# Altium schematic sheet Power.SchDoc
size A3
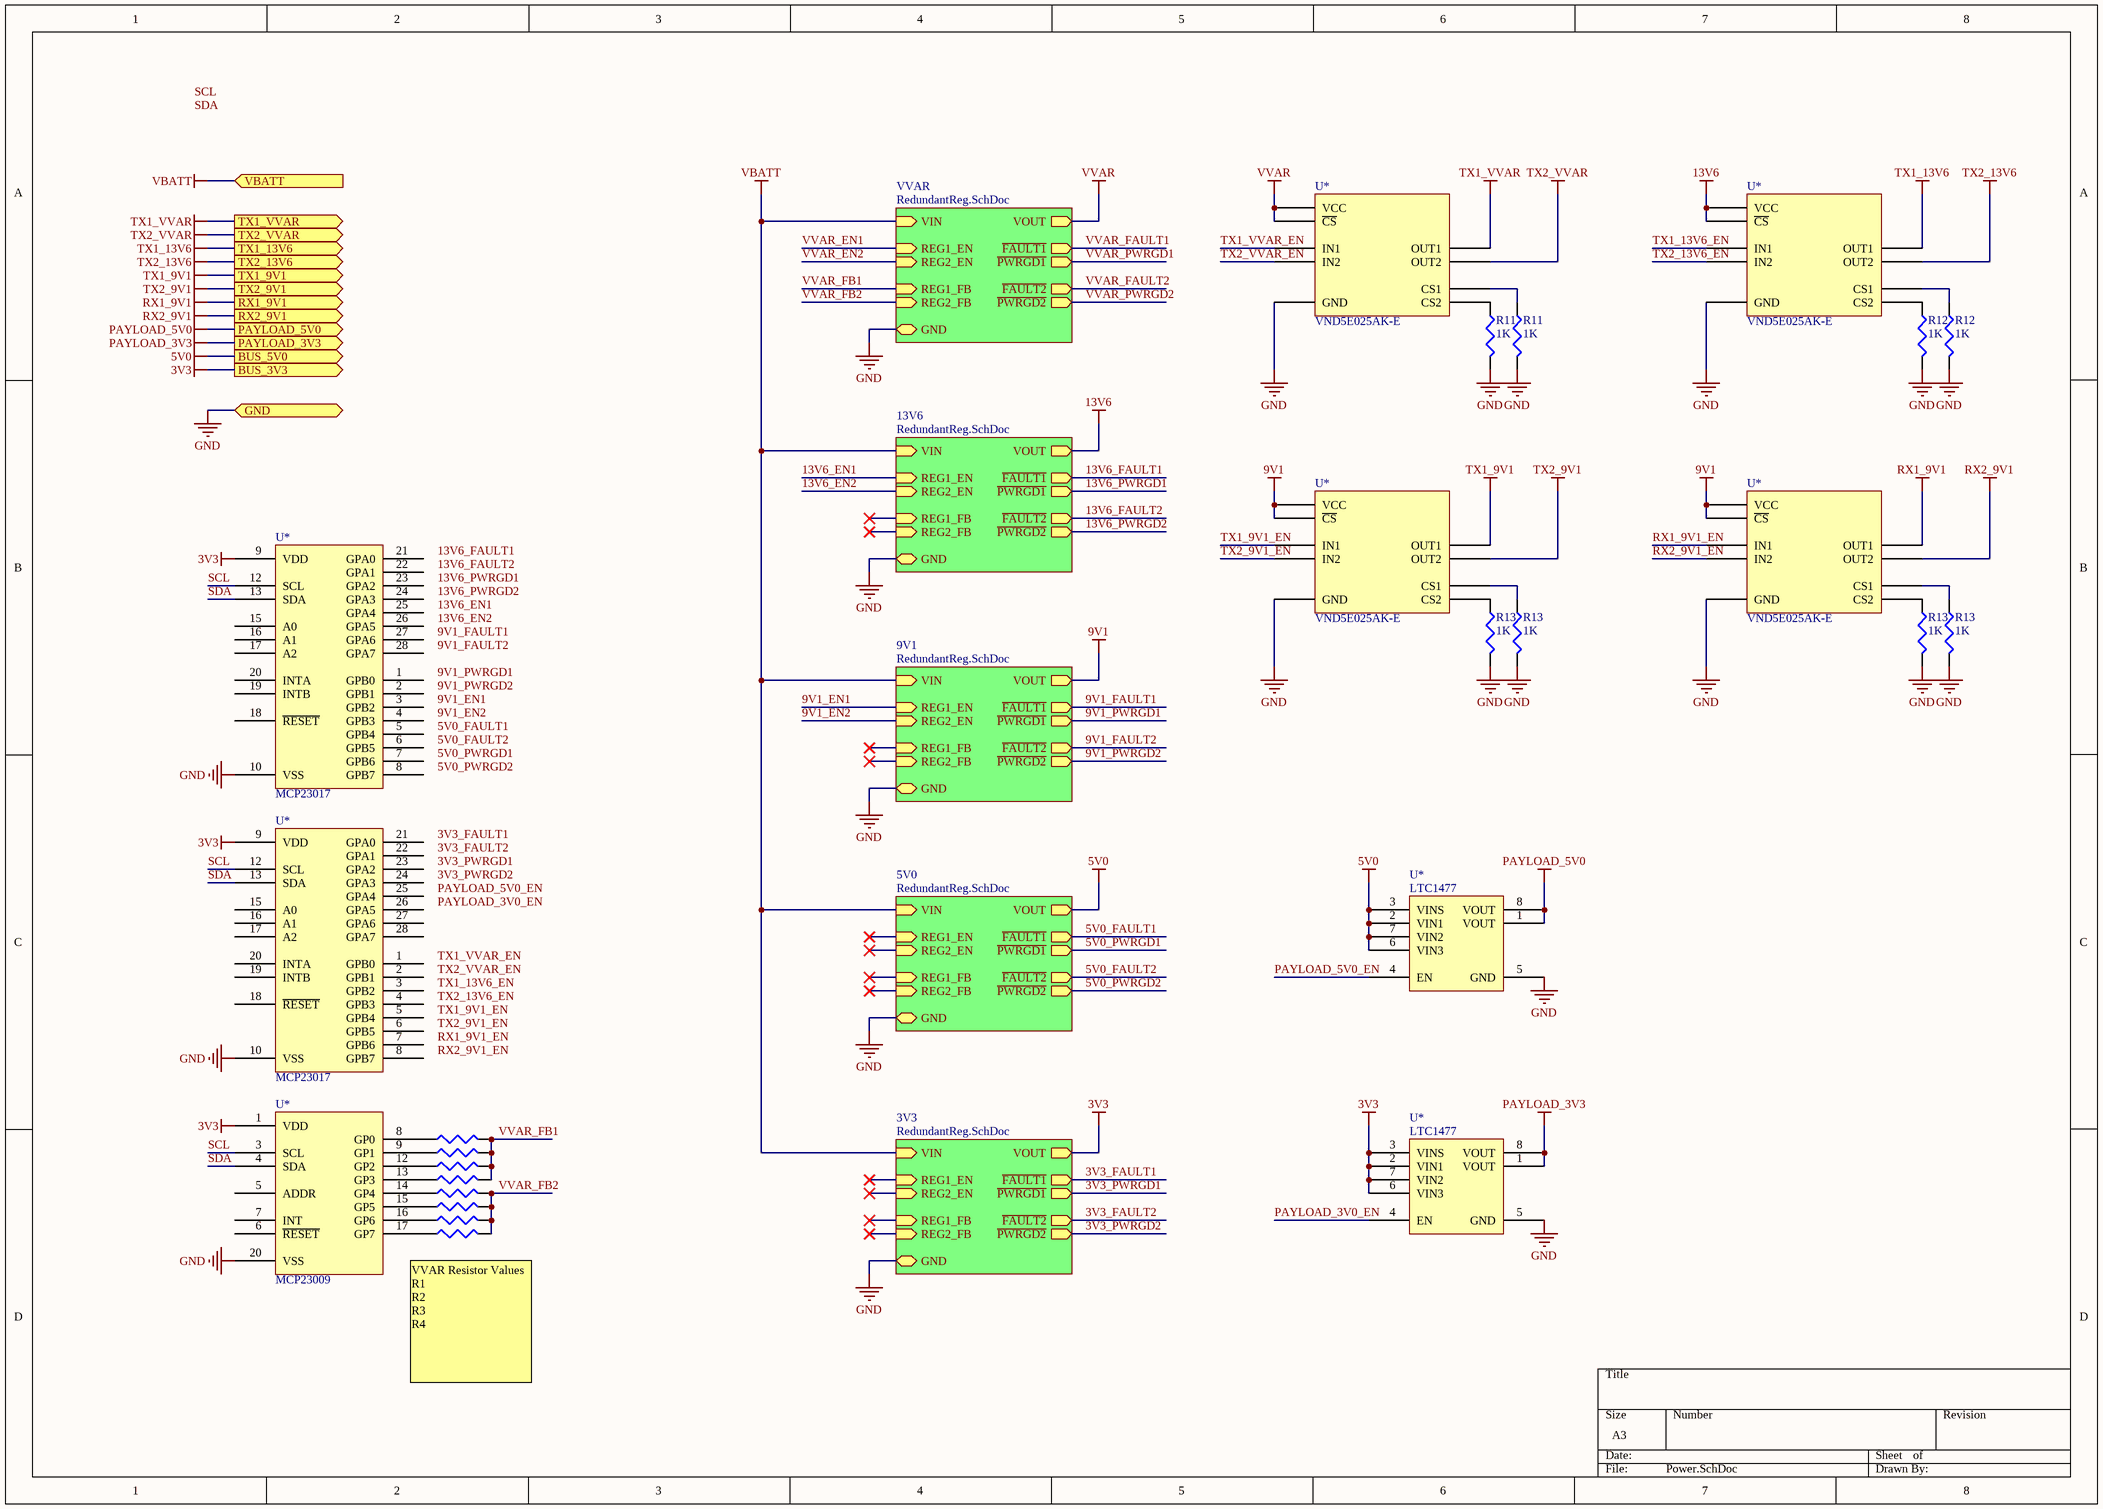
[diagram p0: Power.SchDoc]

## Parts
(Parts that share a designator on the sheet are numbered #1, #2 ... from top to bottom, then left to right.)
R11#1  value 1K  [R0805M]
R11#2  value 1K  [R0805M]
R12#1  value 1K  [R0805M]
R12#2  value 1K  [R0805M]
R13#1  value 1K  [R0805M]
R13#2  value 1K  [R0805M]
R13#3  value 1K  [R0805M]
R13#4  value 1K  [R0805M]
R?#1  VSET_1  [R0805M]  (value not drawn)
R?#2  VSET_1  [R0805M]  (value not drawn)
R?#3  VSET_1  [R0805M]  (value not drawn)
R?#4  VSET_1  [R0805M]  (value not drawn)
R?#5  VSET_1  [R0805M]  (value not drawn)
R?#6  VSET_1  [R0805M]  (value not drawn)
R?#7  VSET_1  [R0805M]  (value not drawn)
R?#8  VSET_1  [R0805M]  (value not drawn)
U*#1  VND5E025AK-E  [SSO24]
U*#2  VND5E025AK-E  [SSO24]
U*#3  VND5E025AK-E  [SSO24]
U*#4  VND5E025AK-E  [SSO24]
U*#5  MCP23017  [SSOP28]
U*#6  LTC1477  [SO8]
U*#7  MCP23017  [SSOP28]
U*#8  LTC1477  [SO8]
U*#9  MCP23009  [SSOP20]

## Sub-sheets
3V3 = RedundantReg.SchDoc: REG1_EN (in), REG2_EN (in), VIN (in), VOUT (out), REG1_FB (in), REG2_FB (in), GND, ~{FAULT1} (out), ~{FAULT2} (out), ~{PWRGD1} (out), ~{PWRGD2} (out)
5V0 = RedundantReg.SchDoc: REG1_EN (in), REG2_EN (in), VIN (in), VOUT (out), REG1_FB (in), REG2_FB (in), GND, ~{FAULT1} (out), ~{FAULT2} (out), ~{PWRGD1} (out), ~{PWRGD2} (out)
9V1 = RedundantReg.SchDoc: REG1_EN (in), REG2_EN (in), VIN (in), VOUT (out), REG1_FB (in), REG2_FB (in), GND, ~{FAULT1} (out), ~{FAULT2} (out), ~{PWRGD1} (out), ~{PWRGD2} (out)
13V6 = RedundantReg.SchDoc: REG1_EN (in), REG2_EN (in), VIN (in), VOUT (out), REG1_FB (in), REG2_FB (in), GND, ~{FAULT1} (out), ~{FAULT2} (out), ~{PWRGD1} (out), ~{PWRGD2} (out)
VVAR = RedundantReg.SchDoc: REG1_EN (in), REG2_EN (in), VIN (in), VOUT (out), REG1_FB (in), REG2_FB (in), GND, ~{FAULT1} (out), ~{FAULT2} (out), ~{PWRGD1} (out), ~{PWRGD2} (out)

## Ports
BUS_3V3 (out), BUS_5V0 (out), GND, PAYLOAD_3V3 (out), PAYLOAD_5V0 (out), RX1_9V1 (out), RX2_9V1 (out), TX1_9V1 (out), TX1_13V6 (out), TX1_VVAR (out), TX2_9V1 (out), TX2_13V6 (out), TX2_VVAR (out), VBATT (in)

## Nets
3V3: U*#5.9(VDD) U*#7.9(VDD) U*#8.2(VIN1) U*#8.3(VINS) U*#8.6(VIN3) U*#8.7(VIN2) U*#9.1(VDD) ; port BUS_3V3, sheet 3V3/VOUT
5V0: U*#6.2(VIN1) U*#6.3(VINS) U*#6.6(VIN3) U*#6.7(VIN2) ; port BUS_5V0, sheet 5V0/VOUT
9V1: U*#3.CS_DIS(~{CS}) U*#3.VCC U*#4.CS_DIS(~{CS}) U*#4.VCC ; sheet 9V1/VOUT
13V6: U*#2.CS_DIS(~{CS}) U*#2.VCC ; sheet 13V6/VOUT
GND: R11#1.2 R11#2.2 R12#1.2 R12#2.2 R13#1.2 R13#2.2 R13#3.2 R13#4.2 U*#1.GND U*#2.GND U*#3.GND U*#4.GND U*#5.10(VSS) U*#6.5(GND) U*#7.10(VSS) U*#8.5(GND) U*#9.20(VSS) ; port GND, sheet 13V6/GND, sheet 9V1/GND, sheet 5V0/GND, sheet 3V3/GND, sheet VVAR/GND
PAYLOAD_3V3: U*#8.1(VOUT) U*#8.8(VOUT) ; port PAYLOAD_3V3
PAYLOAD_5V0: U*#6.1(VOUT) U*#6.8(VOUT) ; port PAYLOAD_5V0
RX1_9V1: U*#4.OUT1 ; port RX1_9V1
RX2_9V1: U*#4.OUT2 ; port RX2_9V1
TX1_9V1: U*#3.OUT1 ; port TX1_9V1
TX1_13V6: U*#2.OUT1 ; port TX1_13V6
TX1_VVAR: U*#1.OUT1 ; port TX1_VVAR
TX2_9V1: U*#3.OUT2 ; port TX2_9V1
TX2_13V6: U*#2.OUT2 ; port TX2_13V6
TX2_VVAR: U*#1.OUT2 ; port TX2_VVAR
VBATT: port VBATT, sheet 13V6/VIN, sheet 9V1/VIN, sheet 5V0/VIN, sheet 3V3/VIN, sheet VVAR/VIN
VVAR: U*#1.CS_DIS(~{CS}) U*#1.VCC ; sheet VVAR/VOUT
3V3_FAULT1: sheet 3V3/~{FAULT1}
3V3_FAULT2: sheet 3V3/~{FAULT2}
3V3_PWRGD1: sheet 3V3/~{PWRGD1}
3V3_PWRGD2: sheet 3V3/~{PWRGD2}
5V0_FAULT1: sheet 5V0/~{FAULT1}
5V0_FAULT2: sheet 5V0/~{FAULT2}
5V0_PWRGD1: sheet 5V0/~{PWRGD1}
5V0_PWRGD2: sheet 5V0/~{PWRGD2}
9V1_EN1: sheet 9V1/REG1_EN
9V1_EN2: sheet 9V1/REG2_EN
9V1_FAULT1: sheet 9V1/~{FAULT1}
9V1_FAULT2: sheet 9V1/~{FAULT2}
9V1_PWRGD1: sheet 9V1/~{PWRGD1}
9V1_PWRGD2: sheet 9V1/~{PWRGD2}
13V6_EN1: sheet 13V6/REG1_EN
13V6_EN2: sheet 13V6/REG2_EN
13V6_FAULT1: sheet 13V6/~{FAULT1}
13V6_FAULT2: sheet 13V6/~{FAULT2}
13V6_PWRGD1: sheet 13V6/~{PWRGD1}
13V6_PWRGD2: sheet 13V6/~{PWRGD2}
PAYLOAD_3V0_EN: U*#8.4(EN)
PAYLOAD_5V0_EN: U*#6.4(EN)
RX1_9V1_EN: U*#4.IN1
RX2_9V1_EN: U*#4.IN2
SCL: U*#5.12(SCL) U*#7.12(SCL) U*#9.3(SCL)
SDA: U*#5.13(SDA) U*#7.13(SDA) U*#9.4(SDA)
TX1_9V1_EN: U*#3.IN1
TX1_13V6_EN: U*#2.IN1
TX1_VVAR_EN: U*#1.IN1
TX2_9V1_EN: U*#3.IN2
TX2_13V6_EN: U*#2.IN2
TX2_VVAR_EN: U*#1.IN2
VVAR_EN1: sheet VVAR/REG1_EN
VVAR_EN2: sheet VVAR/REG2_EN
VVAR_FAULT1: sheet VVAR/~{FAULT1}
VVAR_FAULT2: sheet VVAR/~{FAULT2}
VVAR_FB1: R?#1.2 R?#2.2 R?#3.2 R?#4.2 ; sheet VVAR/REG1_FB
VVAR_FB2: R?#5.2 R?#6.2 R?#7.2 R?#8.2 ; sheet VVAR/REG2_FB
VVAR_PWRGD1: sheet VVAR/~{PWRGD1}
VVAR_PWRGD2: sheet VVAR/~{PWRGD2}
NetR11#1_1: R11#1.1 U*#1.CS2
NetR11#2_1: R11#2.1 U*#1.CS1
NetR12#1_1: R12#1.1 U*#2.CS2
NetR12#2_1: R12#2.1 U*#2.CS1
NetR13#1_1: R13#1.1 U*#3.CS2
NetR13#2_1: R13#2.1 U*#3.CS1
NetR13#3_1: R13#3.1 U*#4.CS2
NetR13#4_1: R13#4.1 U*#4.CS1
NetR?#1_1: R?#1.1 U*#9.8(GP0)
NetR?#2_1: R?#2.1 U*#9.9(GP1)
NetR?#3_1: R?#3.1 U*#9.12(GP2)
NetR?#4_1: R?#4.1 U*#9.13(GP3)
NetR?#5_1: R?#5.1 U*#9.14(GP4)
NetR?#6_1: R?#6.1 U*#9.15(GP5)
NetR?#7_1: R?#7.1 U*#9.16(GP6)
NetR?#8_1: R?#8.1 U*#9.17(GP7)

Not connected (* = marked no-connect by the designer): U*#5 1(GPB0) 2(GPB1) 3(GPB2) 4(GPB3) 5(GPB4) 6(GPB5) 7(GPB6) 8(GPB7) 15(A0) 16(A1) 17(A2) 18(~{RESET}) 19(INTB) 20(INTA) 21(GPA0) 22(GPA1) 23(GPA2) 24(GPA3) 25(GPA4) 26(GPA5) 27(GPA6) 28(GPA7); U*#7 1(GPB0) 2(GPB1) 3(GPB2) 4(GPB3) 5(GPB4) 6(GPB5) 7(GPB6) 8(GPB7) 15(A0) 16(A1) 17(A2) 18(~{RESET}) 19(INTB) 20(INTA) 21(GPA0) 22(GPA1) 23(GPA2) 24(GPA3) 25(GPA4) 26(GPA5) 27(GPA6) 28(GPA7); U*#9 5(ADDR) 6(~{RESET}) 7(INT)

## Notes on the sheet
- VVAR Resistor Values
  R1
  R2
  R3
  R4
- Labels drawn without touching a wire or pin: 3V3_FAULT1, 3V3_FAULT2, 3V3_PWRGD1, 3V3_PWRGD2, 5V0_FAULT1, 5V0_FAULT2, 5V0_PWRGD1, 5V0_PWRGD2, 9V1_EN1, 9V1_EN2, 9V1_FAULT1, 9V1_FAULT2, 9V1_PWRGD1, 9V1_PWRGD2, 13V6_EN1, 13V6_EN2, 13V6_FAULT1, 13V6_FAULT2, 13V6_PWRGD1, 13V6_PWRGD2, PAYLOAD_3V0_EN, PAYLOAD_5V0_EN, RX1_9V1_EN, RX2_9V1_EN, SCL, SDA, TX1_9V1_EN, TX1_13V6_EN, TX1_VVAR_EN, TX2_9V1_EN, TX2_13V6_EN, TX2_VVAR_EN

## Library data of the parts
R11#1 R11#2 R12#1 R12#2 R13#1-R13#4 R?#1-R?#8 = Res3: Resistor; Published: 8-Jun-2000; LatestRevisionDate: 29-May-2009; LatestRevisionNote: IPC-7351 Footprint Added.; PackageReference: J1-0603; Publisher: Altium Limited; PackageDescription: Chip Resistor
U*#1-U*#4 = VND5E025AK-E: Double channel high-side driver with analog current sense
U*#5 U*#7 = MCP23017: 16-Bit I/O Expander with Serial Interface
U*#6 U*#8 = LTC1477: Single Protected High Side Switches
U*#9 = MCP23009: 8-Bit I/O Expander with Open-Drain Outputs